# Altium schematic sheet Power.SchDoc: Power
size A3; CompanyName: Novelda AS; Organization: Novelda AS; Address1: Gjerdrums vei 8; Address2: NO-0484 Oslo; Address3: Norway; Revision: 1.A; SheetNumber: 2; SheetTotal: 3; Classification: Restricted; Size: A3; Project: X4M01; ProjectName: Prosject Name
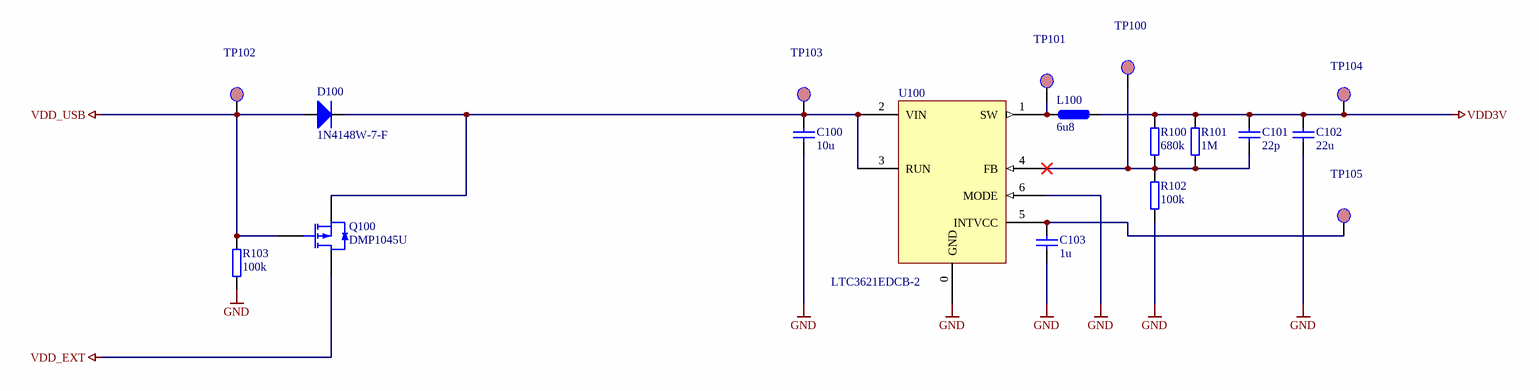
[diagram p0: Power.SchDoc]

## Parts
C100  10u  [0603-CAPACITOR-NONPOL]
C101  22p  [0402-CAPACITOR-NONPOL]
C102  22u  [0603-CAPACITOR-NONPOL]
C103  1u  [0402-CAPACITOR-NONPOL]
D100  1N4148W-7-F  [200048]
L100  6u8  [200059]
Q100  DMP1045U  [200049]
R100  680k  [0402-RESISTOR]
R101  1M  [0402-RESISTOR]
R102  100k  [0402-RESISTOR]
R103  100k  [0402-RESISTOR]
TP100  TP-MDA  [ALTIUM-0001]  (value not drawn)  (no BOM)
TP101  TP-MDA  [ALTIUM-0001]  (value not drawn)  (no BOM)
TP102  TP-MDA  [ALTIUM-0001]  (value not drawn)  (no BOM)
TP103  TP-MDA  [ALTIUM-0001]  (value not drawn)  (no BOM)
TP104  TP-MDA  [ALTIUM-0001]  (value not drawn)  (no BOM)
TP105  TP-MDA  [ALTIUM-0001]  (value not drawn)  (no BOM)
U100  LTC3621EDCB-2  [200038]

## Nets
GND: C100.1 C102.1 C103.1 R102.1 R103.1 U100.0(GND) U100.6(MODE)
VDD3V: C101.2 C102.2 L100.2 R100.2 R101.2 TP104.1
VDD_EXT: Q100.3(D)
VDD_USB: D100.A Q100.1(G) R103.2 TP102.1
NetC100_2: C100.2 D100.K Q100.2(S) TP103.1 U100.2(VIN) U100.3(RUN)
NetC101_1: C101.1 R100.1 R101.1 R102.2 TP100.1 U100.4(FB)
NetC103_2: C103.2 TP105.1 U100.5(INTVCC)
NetL100_1: L100.1 TP101.1 U100.1(SW)

## Notes on the sheet
- Size:
- Date:
- ItemNo:
- Sheet:
- of
- Title:
- Project:
- Classification:
- Copyright © 2017 Novelda AS

## Library data of the parts
C100 = 200011: CAPACITOR, 10u, 0603, 20%, 6V3, X5R; ItemNo: 200011; Component Status: Active; Value: 10u; Component Category: Capacitor; Manufacturer: --; Supplier: Farnell Norge; SupplierCatNo: 2611921
C101 = 200060: CAPACITOR, 22p, 0402, 5%, 25V, NP0; ItemNo: 200060; Component Status: Active; Value: 22p; Component Category: Capacitor; Manufacturer: --; Supplier: Farnell Norge; SupplierCatNo: 2524767
C102 = 200236: CAPACITOR, 22u, 0603, 20%, 6V3, X5R; ItemNo: 200236; Component Status: Active; Value: 22u; Component Category: Capacitor; Manufacturer: --; ClassName: -; Notes: -; Supplier: Farnell Norge; SupplierCatNo: 2469395
C103 = 200001: CAPACITOR, 1u, 0402, 10%, 10V, X5R; ItemNo: 200001; Component Status: Active; Value: 1u; Component Category: Capacitor; Manufacturer: --; Supplier: Farnell Norge; SupplierCatNo: 1759381
D100 = 200164: DIODE, 1N4148W-7-F, SWITCH, 300MA, 100V, SOD123; ItemNo: 200164; Component Status: New; Value: 1N4148W-7-F; Component Category: Diode; Manufacturer: --; ClassName: -; Notes: -; Supplier: Digi-Key; SupplierCatNo: 1N4148W-FDICT-ND
L100 = 200059: INDUCTOR, PWR, 6.8UH,0.76A,10%,120MHZ; Manufacturer: Coilcraft; MPN: 1008PS-682KLB; Component Status: Active; ItemNo: 200059; Value: 6u8; Component Category: Inductor; Supplier: Farnell Norge; SupplierCatNo: 2286875
Q100 = 200049: MOSFET, P-CHANNEL, 12V, 4A, 31mOhm; Manufacturer: Diodes Incorporated; Component Status: Active; Component Category: Transistor; ItemNo: 200049; Value: DMP1045U; MPN: DMP1045U; Supplier: Farnell Norge; SupplierCatNo: 2061526
R100 = 200033: RESISTOR, 680k, 0402, 1%, 63mW; ItemNo: 200033; Component Status: Active; Value: 680k; Component Category: Resistor; Manufacturer: --; Supplier: Farnell Norge; SupplierCatNo: 2331556
R101 = 200023: RESISTOR, 1M, 0402, 5%, 63mW; ItemNo: 200023; Component Status: Active; Value: 1M; Component Category: Resistor; Manufacturer: --; Supplier: Farnell Norge; SupplierCatNo: 1174172
R102 R103 = 200027: RESISTOR, 100k, 0402, 1%, 63mW; ItemNo: 200027; Component Status: Active; Value: 100k; Component Category: Resistor; Manufacturer: --; Supplier: Farnell Norge; SupplierCatNo: 9239472
TP100-TP103 TP105 = ALTIUM-0023: TESTPOINT FOR MDA-TEST, 1mm ROUND, SMD; Component Status: Active; Component Category: Misc; TP_Type: MDA; ItemNo: ALTIUM-0023; Value: TP-MDA; ClassName: MDA-Testpoint
TP104 = ALTIUM-0023: TESTPOINT FOR MDA-TEST, 1mm ROUND, SMD; Component Status: Active; Component Category: Misc; TP_Type: Testjig,MDA; TP_Notes: VDD3V Output; ItemNo: ALTIUM-0023; Value: TP-MDA; ClassName: MDA-Testpoint
U100 = 200038: LTC3621EDCB-2, BUCK, 2.7-17V, 2.2MHZ, 1A, 0.6-17V, 6DFN; Manufacturer: Linear Technology; MPN: LTC3621EDCB-2#TRMBF; Component Status: Active; Component Category: Power Supply IC; ItemNo: 200038; Value: LTC3621EDCB-2; Supplier: Farnell Norge; SupplierCatNo: 2322398